# EAGLE design BCP_Experimental_1 (EAGLE 9.6.1)
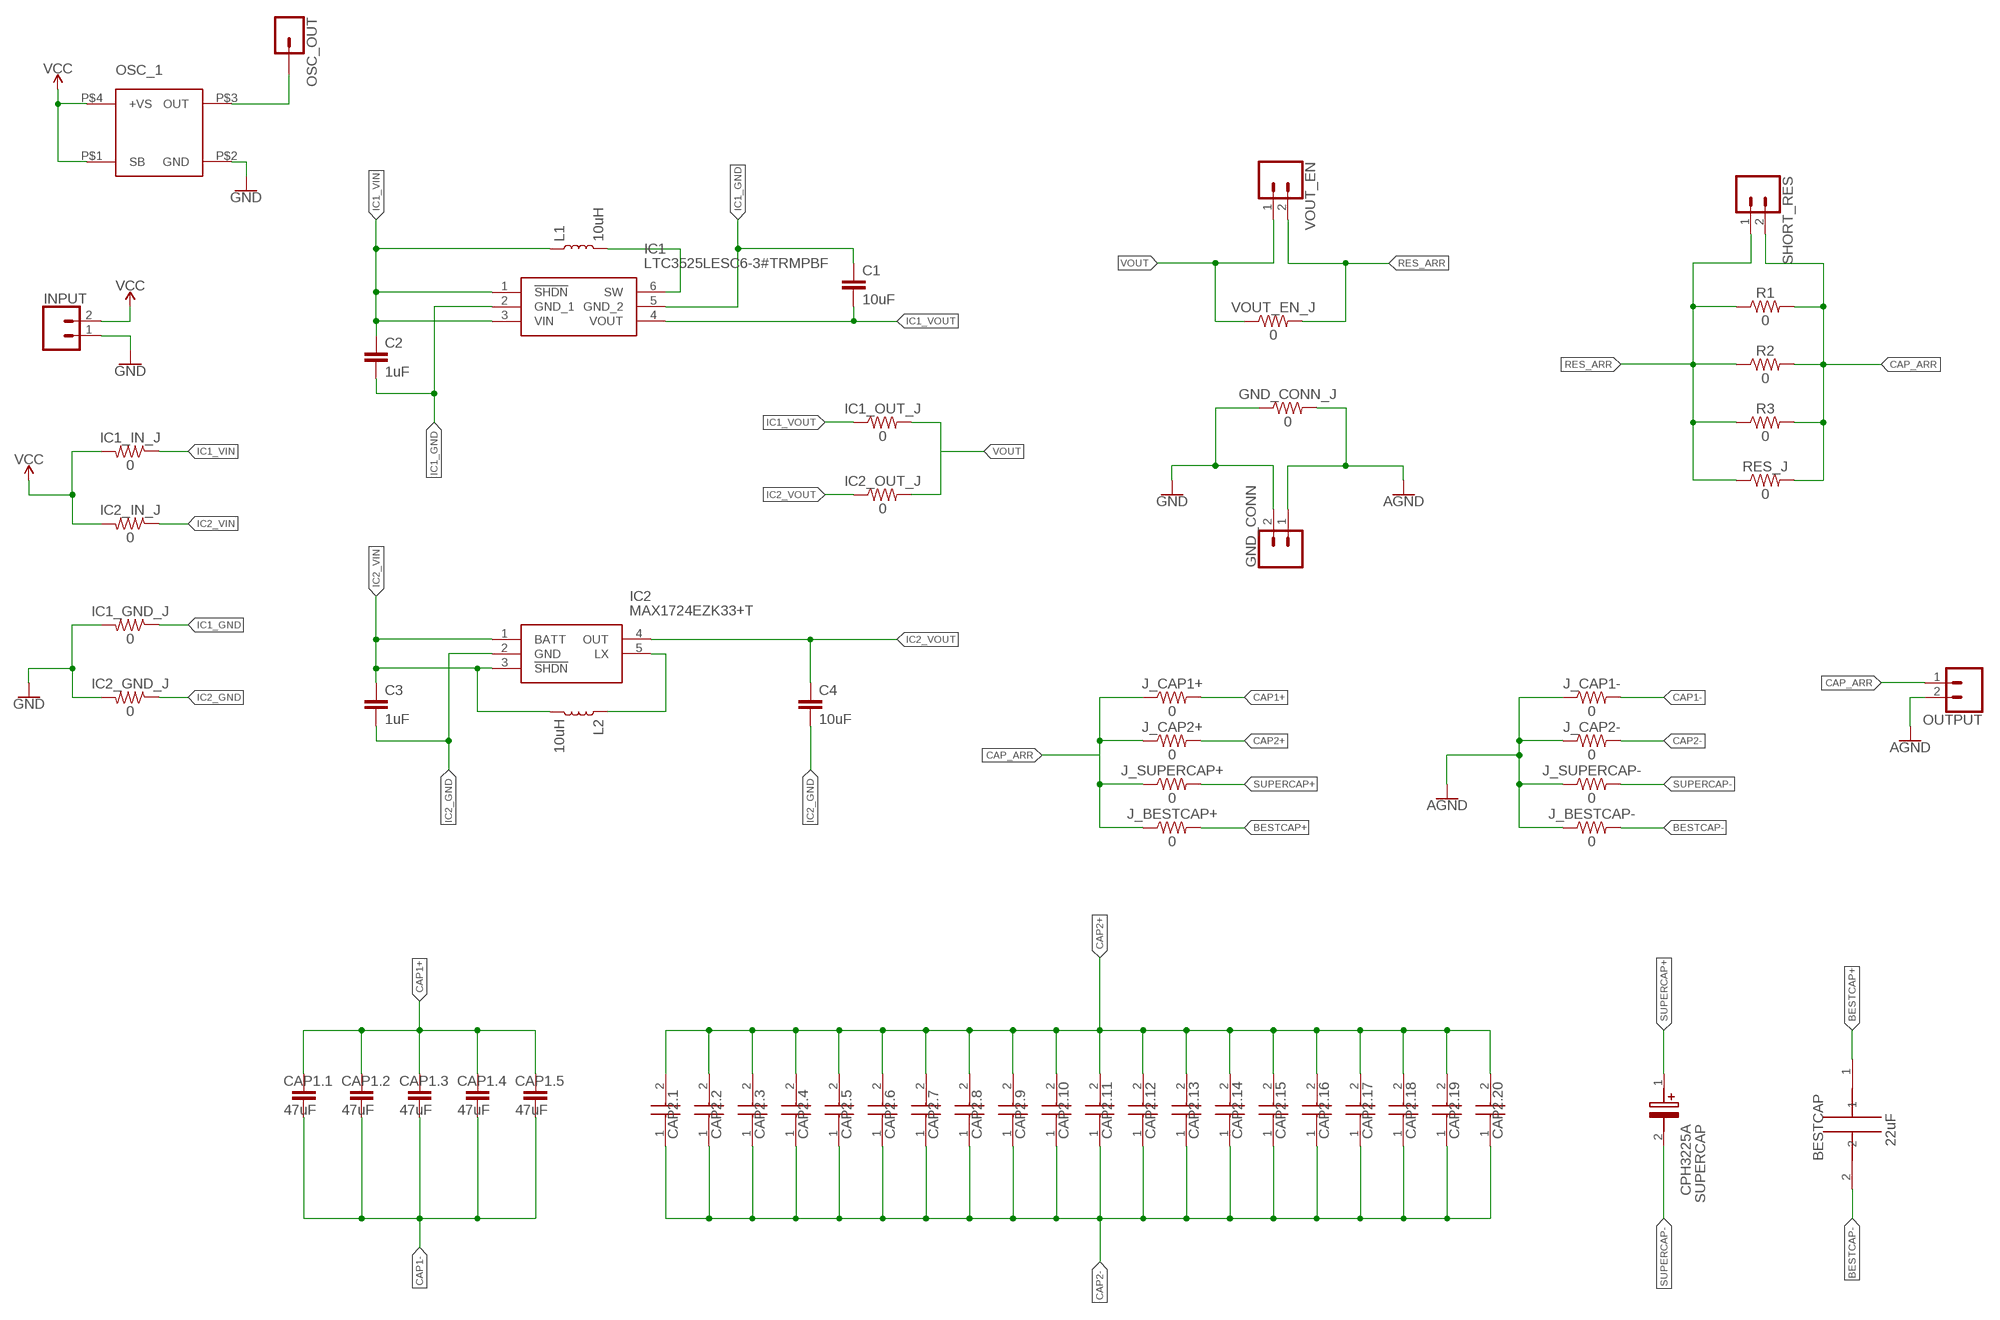
[diagram p0: schematic, sheet 1]

## Parts
BESTCAP  BZ054B223ZNB  [BZ054B223ZNB]
C1  10uF  CAP-0603  [0603]
C2  1uF  CAP-0603  [0603]
C3  1uF  CAP-0603  [0603]
C4  10uF  CAP-0603  [0603]
CAP1.1  47uF  CAP-1206  [1206]
CAP1.2  47uF  CAP-1206  [1206]
CAP1.3  47uF  CAP-1206  [1206]
CAP1.4  47uF  CAP-1206  [1206]
CAP1.5  47uF  CAP-1206  [1206]
CAP2.1  AMK432BJ477MM-T  [CAPC4532X270N]
CAP2.2  AMK432BJ477MM-T  [CAPC4532X270N]
CAP2.3  AMK432BJ477MM-T  [CAPC4532X270N]
CAP2.4  AMK432BJ477MM-T  [CAPC4532X270N]
CAP2.5  AMK432BJ477MM-T  [CAPC4532X270N]
CAP2.6  AMK432BJ477MM-T  [CAPC4532X270N]
CAP2.7  AMK432BJ477MM-T  [CAPC4532X270N]
CAP2.8  AMK432BJ477MM-T  [CAPC4532X270N]
CAP2.9  AMK432BJ477MM-T  [CAPC4532X270N]
CAP2.10  AMK432BJ477MM-T  [CAPC4532X270N]
CAP2.11  AMK432BJ477MM-T  [CAPC4532X270N]
CAP2.12  AMK432BJ477MM-T  [CAPC4532X270N]
CAP2.13  AMK432BJ477MM-T  [CAPC4532X270N]
CAP2.14  AMK432BJ477MM-T  [CAPC4532X270N]
CAP2.15  AMK432BJ477MM-T  [CAPC4532X270N]
CAP2.16  AMK432BJ477MM-T  [CAPC4532X270N]
CAP2.17  AMK432BJ477MM-T  [CAPC4532X270N]
CAP2.18  AMK432BJ477MM-T  [CAPC4532X270N]
CAP2.19  AMK432BJ477MM-T  [CAPC4532X270N]
CAP2.20  AMK432BJ477MM-T  [CAPC4532X270N]
GND_CONN  CONN_02  [1X02]
GND_CONN_J  0  RESISTOR0402  [0402]
IC1  LTC3525LESC6-3#TRMPBF  [SOT65P210X100-6N]
IC1_GND_J  0  RESISTOR0402  [0402]
IC1_IN_J  0  RESISTOR0402  [0402]
IC1_OUT_J  0  RESISTOR0402  [0402]
IC2  MAX1724EZK33+T  [SOT95P275X110-5N]
IC2_GND_J  0  RESISTOR0402  [0402]
IC2_IN_J  0  RESISTOR0402  [0402]
IC2_OUT_J  0  RESISTOR0402  [0402]
INPUT  CONN_02  [1X02]
J_BESTCAP+  0  RESISTOR0402  [0402]
J_BESTCAP-  0  RESISTOR0402  [0402]
J_CAP1+  0  RESISTOR0402  [0402]
J_CAP1-  0  RESISTOR0402  [0402]
J_CAP2+  0  RESISTOR0402  [0402]
J_CAP2-  0  RESISTOR0402  [0402]
J_SUPERCAP+  0  RESISTOR0402  [0402]
J_SUPERCAP-  0  RESISTOR0402  [0402]
L1  10uH  INDUCTOR-0603-15NH  [0603]
L2  10uH  INDUCTOR-0603-15NH  [0603]
OSC_1  830202536501  [830202536501]
OSC_OUT  CONN_01  [1X01]
OUTPUT  CONN_02  [1X02]
R1  0  RESISTOR0603  [0603]
R2  0  RESISTOR0603  [0603]
R3  0  RESISTOR0603  [0603]
RES_J  0  RESISTOR0402  [0402]
SHORT_RES  CONN_02  [1X02]
SUPERCAP  CPH3225A  [CPH3225A]
VOUT_EN  CONN_02  [1X02]
VOUT_EN_J  0  RESISTOR0402  [0402]

## Nets
AGND: GND_CONN.1 GND_CONN_J.2 J_BESTCAP-.1 J_CAP1-.1 J_CAP2-.1 J_SUPERCAP-.1 OUTPUT.2
BESTCAP+: BESTCAP.1 J_BESTCAP+.2
BESTCAP-: BESTCAP.2 J_BESTCAP-.2
CAP1+: CAP1.1.1 CAP1.2.1 CAP1.3.1 CAP1.4.1 CAP1.5.1 J_CAP1+.2
CAP1-: CAP1.1.2 CAP1.2.2 CAP1.3.2 CAP1.4.2 CAP1.5.2 J_CAP1-.2
CAP2+: CAP2.1.2 CAP2.2.2 CAP2.3.2 CAP2.4.2 CAP2.5.2 CAP2.6.2 CAP2.7.2 CAP2.8.2 CAP2.9.2 CAP2.10.2 CAP2.11.2 CAP2.12.2 CAP2.13.2 CAP2.14.2 CAP2.15.2 CAP2.16.2 CAP2.17.2 CAP2.18.2 CAP2.19.2 CAP2.20.2 J_CAP2+.2
CAP2-: CAP2.1.1 CAP2.2.1 CAP2.3.1 CAP2.4.1 CAP2.5.1 CAP2.6.1 CAP2.7.1 CAP2.8.1 CAP2.9.1 CAP2.10.1 CAP2.11.1 CAP2.12.1 CAP2.13.1 CAP2.14.1 CAP2.15.1 CAP2.16.1 CAP2.17.1 CAP2.18.1 CAP2.19.1 CAP2.20.1 J_CAP2-.2
CAP_ARR: J_BESTCAP+.1 J_CAP1+.1 J_CAP2+.1 J_SUPERCAP+.1 OUTPUT.1 R1.2 R2.2 R3.2 RES_J.2 SHORT_RES.2
GND: GND_CONN.2 GND_CONN_J.1 IC1_GND_J.2 IC2_GND_J.2 INPUT.1 OSC_1.P$2(GND)
IC1_GND: C1.1 C2.2 IC1.2(GND_1) IC1.5(GND_2) IC1_GND_J.1
IC1_VIN: C2.1 IC1.1(!SHDN) IC1.3(VIN) IC1_IN_J.1 L1.1
IC1_VOUT: C1.2 IC1.4(VOUT) IC1_OUT_J.1
IC2_GND: C3.2 C4.2 IC2.2(GND) IC2_GND_J.1
IC2_VIN: C3.1 IC2.1(BATT) IC2.3(!SHDN) IC2_IN_J.1 L2.2
IC2_VOUT: C4.1 IC2.4(OUT) IC2_OUT_J.1
N$1: IC1.6(SW) L1.2
N$3: IC2.5(LX) L2.1
N$4: OSC_1.P$3(OUT) OSC_OUT.1
RES_ARR: R1.1 R2.1 R3.1 RES_J.1 SHORT_RES.1 VOUT_EN.2 VOUT_EN_J.2
SUPERCAP+: J_SUPERCAP+.2 SUPERCAP.1(+)
SUPERCAP-: J_SUPERCAP-.2 SUPERCAP.2(-)
VCC: IC1_IN_J.2 IC2_IN_J.2 INPUT.2 OSC_1.P$1(SB) OSC_1.P$4(+VS)
VOUT: IC1_OUT_J.2 IC2_OUT_J.2 VOUT_EN.1 VOUT_EN_J.1

## Library data of the parts
BESTCAP = BZ054B223ZNB:BZ054B223ZNB
C1-C4 CAP1.1-CAP1.5 = SparkFun-Capacitors:CAP
CAP2.1-CAP2.20 = AMK432BJ477MM-T:AMK432BJ477MM-T: Multilayer Ceramic Capacitors MLCC - SMD/SMT 470uF 4V X5R +/-20% 1812 HiCV Source: Datasheet <http://ds3.yuden.co.jp/TYCOMPAS/eu/detail.do?productNo=AMK432BJ477MM-T&dataUnit=M>; DESCRIPTION: Multilayer Ceramic Capacitors MLCC - SMD/SMT 470uF 4V X5R +/-20% 1812 HiCV; HEIGHT: 2.7mm; MANUFACTURER_NAME: TAIYO YUDEN; MANUFACTURER_PART_NUMBER: AMK432BJ477MM-T; MOUSER_PART_NUMBER: 963-AMK432BJ477MM-T; MOUSER_PRICE-STOCK: https://www.mouser.co.uk/ProductDetail/Taiyo-Yuden/AMK432BJ477MM-T/?qs=3jdCaFhktORSvqRP1WUzhQ%3D%3D
GND_CONN INPUT OUTPUT SHORT_RES VOUT_EN = SparkFun-Connectors:CONN_02: Multi connection point. Often used as Generic Header-pin footprint for 0.1 inch spaced/style header connections On any of the 0.1 inch spaced packages, you can populate with these: Break Away Headers - Straight <https://www.sparkfun.com/products/116> (PRT-00116) Break Away Male Headers - Right Angle <https://www.sparkfun.com/products/553> (PRT-00553) Female Headers <https://www.sparkfun.com/products/115> (PRT-00115) Break Away Headers - Machine Pin <https://www.sparkfun.com/products/117> (PRT-00117) Break Away Female Headers - Swiss Machine Pin <https://www.sparkfun.com/products/743> (PRT-00743) For SCREWTERMINALS and SPRING TERMINALS visit here: Screw Terimnals on SparkFun.com <https://www.sparkfun.com/search/results?term=Screw+Terminals> (5mm/3.5mm/2.54mm spacing) This device is also useful as a general connection point to wire up your design to another part of your project. Our various solder wires solder well into these plated through hole pads. Hook-Up Wire - Assortment (Stranded, 22 AWG) <https://www.sparkfun.com/products/11375> (PRT-11375) Hook-Up Wire - Assortment (Solid Core, 22 AWG) <https://www.sparkfun.com/products/11367> (PRT-11367) View the entire wire category on our website here <https://www.sparkfun.com/categories/141> Special notes: Molex polarized connector foot print use with: PRT-08233 with associated crimp pins and housings. 2.54_SCREWTERM for use with PRT-10571. 3.5mm Screw Terminal footprints for PRT-08084 5mm Screw Terminal footprints for use with PRT-08432
GND_CONN_J IC1_GND_J IC1_IN_J IC1_OUT_J IC2_GND_J IC2_IN_J IC2_OUT_J J_BESTCAP+ J_BESTCAP- J_CAP1+ J_CAP1- J_CAP2+ J_CAP2- J_SUPERCAP+ J_SUPERCAP- R1-R3 RES_J VOUT_EN_J = SparkFun-Resistors:RESISTOR: Generic Resistor Package
IC1 = LTC3525LESC6-3#TRMPBF:LTC3525LESC6-3#TRMPBF: Switching Voltage Regulators Low Vt Synch Boost Source: Datasheet <http://www.mouser.com/datasheet/2/609/3525laf-1267913.pdf>; ARROW_PART_NUMBER: LTC3525LESC6-3#TRMPBF; ARROW_PRICE-STOCK: https://www.arrow.com/en/products/ltc3525lesc6-3trmpbf/linear-technology; DESCRIPTION: Switching Voltage Regulators Low Vt Synch Boost; HEIGHT: 1mm; MANUFACTURER_NAME: Linear Technology; MANUFACTURER_PART_NUMBER: LTC3525LESC6-3#TRMPBF; MOUSER_PART_NUMBER: 584-C3525LESC6-3TMPF; MOUSER_PRICE-STOCK: https://www.mouser.com/Search/Refine.aspx?Keyword=584-C3525LESC6-3TMPF
IC2 = MAX1724EZK33+T:MAX1724EZK33+T: Maxim MAX1724EZK33+T, Step Up DC-DC Converter, 150mA, 5-Pin TSOT Source: Datasheet <https://datasheets.maximintegrated.com/en/ds/MAX1722-MAX1724.pdf>; DESCRIPTION: Maxim MAX1724EZK33+T, Step Up DC-DC Converter, 150mA, 5-Pin TSOT; HEIGHT: 1.1mm; MANUFACTURER_NAME: Maxim Integrated; MANUFACTURER_PART_NUMBER: MAX1724EZK33+T; MOUSER_PART_NUMBER: 700-MAX1724EZK33T; MOUSER_PRICE-STOCK: https://www.mouser.co.uk/ProductDetail/Maxim-Integrated/MAX1724EZK33%2bT/?qs=1THa7WoU59ExxSPMjwY5Kw%3D%3D
L1 L2 = SparkFun-Coils:INDUCTOR: Inductors Resist changes in electrical current. Basically a coil of wire. SparkFun Products: SparkFun Load Cell Amplifier - HX711 <https://www.sparkfun.com/products/13879> IOIO-OTG - V2.2 <https://www.sparkfun.com/products/13613>; PROD_ID: NDUC-11660; VALUE: 15nH
OSC_1 = 830202536501:830202536501
OSC_OUT = SparkFun-Connectors:CONN_01: Single connection point. Often used as Generic Header-pin footprint for 0.1 inch spaced/style header connections On any of the 0.1 inch spaced packages, you can populate with these: Break Away Headers - Straight <https://www.sparkfun.com/products/116> (PRT-00116) Break Away Male Headers - Right Angle <https://www.sparkfun.com/products/553> (PRT-00553) Female Headers <https://www.sparkfun.com/products/115> (PRT-00115) Break Away Headers - Machine Pin <https://www.sparkfun.com/products/117> (PRT-00117) Break Away Female Headers - Swiss Machine Pin <https://www.sparkfun.com/products/743> (PRT-00743) This device is also useful as a general connection point to wire up your design to another part of your project. Our various solder wires solder well into these plated through hole pads. Hook-Up Wire - Assortment (Stranded, 22 AWG) <https://www.sparkfun.com/products/11375> (PRT-11375) Hook-Up Wire - Assortment (Solid Core, 22 AWG) <https://www.sparkfun.com/products/11367> (PRT-11367) View the entire wire category on our website here <https://www.sparkfun.com/categories/141> Special notes: SMTSO-256-ET is a "flush mount" nut for a 4-40 screw. We mostly use this on specialty testbeds; it is a nice way to connect hardware to your PCB at an adjustable hieght. Also note, the SNAP packages are for using a snappable style connector. We sell a baggie of snaps and they are also used on two LilyPad designs: Snap Assortment - 30 pack (male and female) <https://www.sparkfun.com/products/11347> (DEV-11347) LilyPad Arduino SimpleSnap <https://www.sparkfun.com/products/10941> (DEV-10941) LilyPad SimpleSnap Protoboard <https://www.sparkfun.com/products/10940> (DEV-10940)
SUPERCAP = CPH3225A:CPH3225A: Supercapacitors / Ultracapacitors Reflow EDLC 3.3V, 11mF, 160 Ohm Source: Datasheet <https://www.sii.co.jp/en/me/datasheets/chip-capacitor/cph3225a/>; DESCRIPTION: Supercapacitors / Ultracapacitors Reflow EDLC 3.3V, 11mF, 160 Ohm; HEIGHT: 1mm; MANUFACTURER_NAME: Seiko Instruments Micro Energy; MANUFACTURER_PART_NUMBER: CPH3225A; MOUSER_PART_NUMBER: 628-CPH3225A; MOUSER_PRICE-STOCK: https://www.mouser.com/Search/Refine.aspx?Keyword=628-CPH3225A

## Board
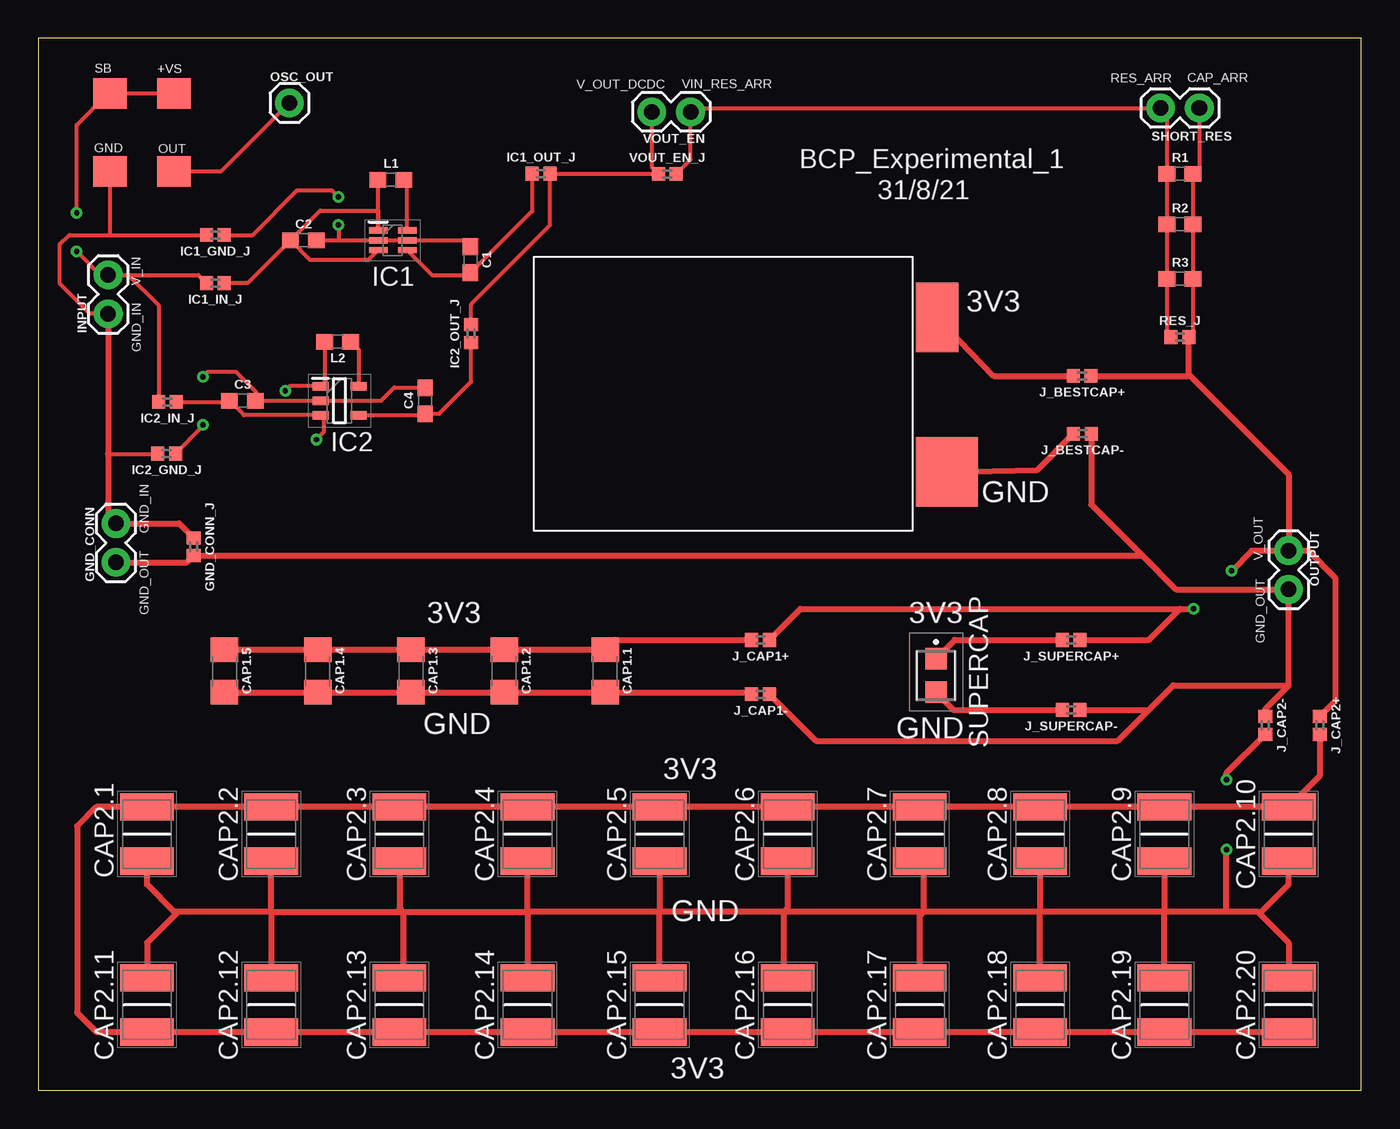
[diagram p1: board, top side]
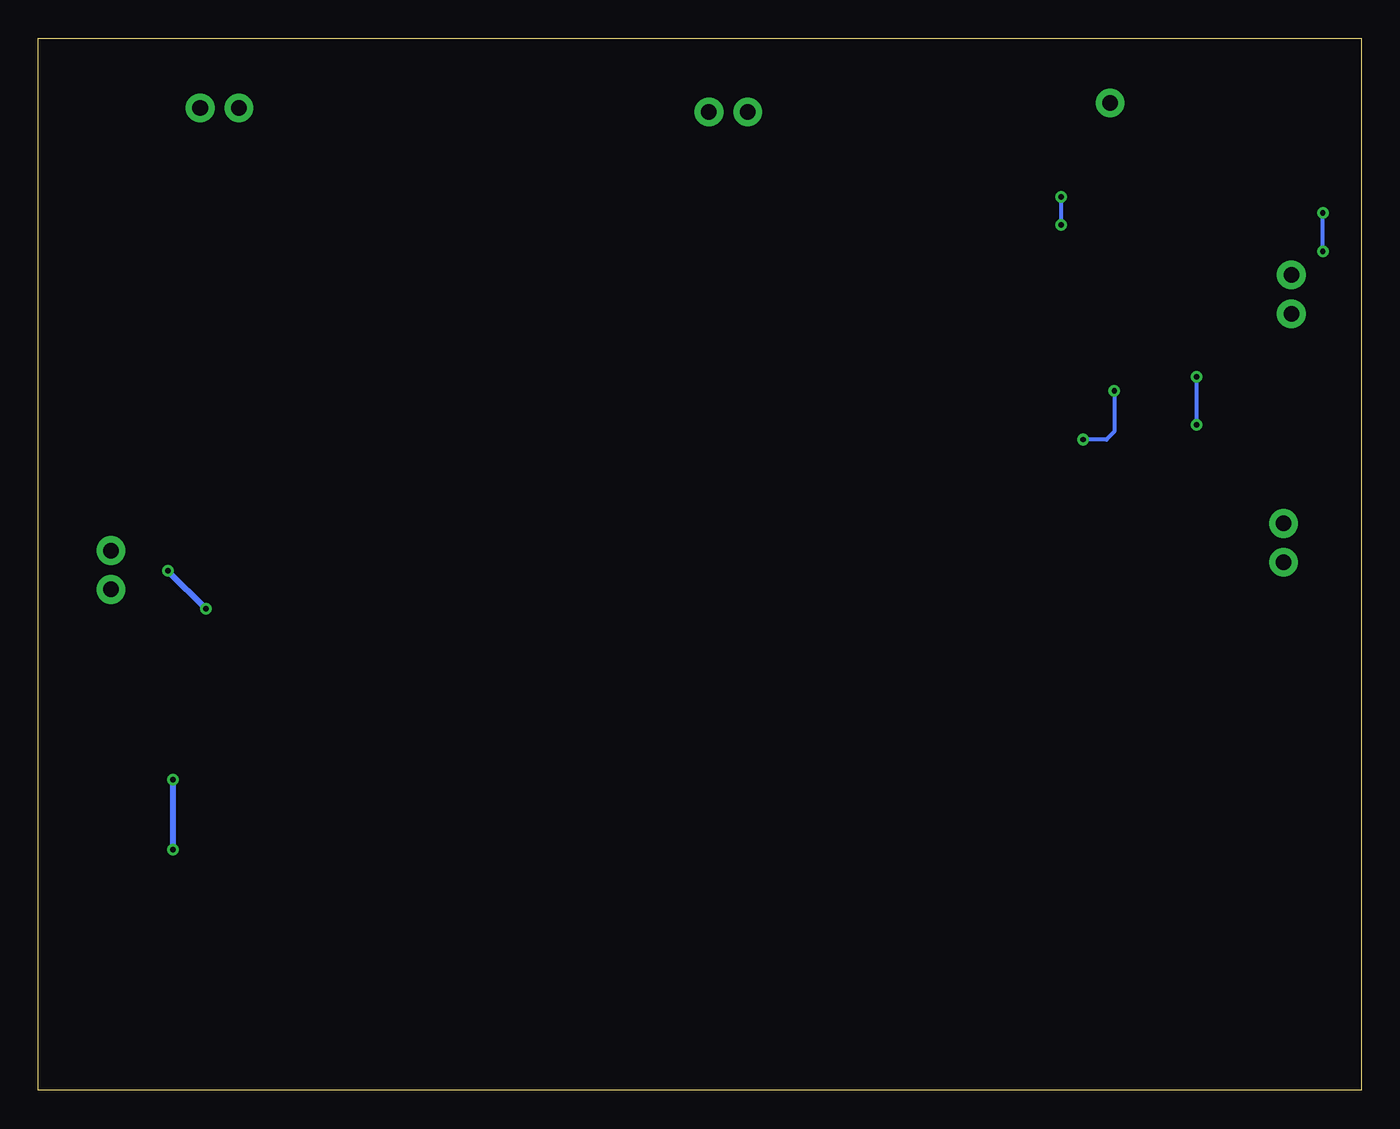
[diagram p2: board, bottom side, seen from below]

Size 86.54 x 68.82 mm. Coordinates in mm from the lower left corner, seen from the top.
Outline: 0,0 86.54,0 86.54,68.82 0,68.82 0,0
Copper layers (1*16): Top 0.035mm / dielectric 1.5mm / Bottom 0.035mm
Design rules "default": minimum track width 6mil, minimum drill 0.35mm, track to track 6mil, track to pad 6mil, pad to pad 6mil, via to via 6mil, smd to smd 6mil, copper to edge 40mil, drill to drill 6mil, minimum pad ring 10mil, minimum via ring 8mil, stop-mask expansion 4mil, vias tented up to drill 0mil, thermal gap 10mil

### Footprints (pad centres in the part's own frame; a part is rotated, then mirrored left to right if it is on the bottom)
BZ054B223ZNB = smd 2.794 x 4.572: 1 1.402,2.05 | smd 4.064 x 4.572: 2 2.037,-8.052
0603 = smd 1.1 x 1: 1 -0.85,0; 2 0.85,0
1206 = smd 1.6 x 1.8: 1 -1.4,0; 2 1.4,0
CAPC4532X270N = smd 1.78 x 3.52: 1 -1.77,0; 2 1.77,0
1X02 = drill 1.016 pad 1.88: 1 0,0; 2 2.54,0
0402 = smd 0.85 x 0.9: 1 -0.58,0; 2 0.58,0
SOT65P210X100-6N = smd 1.2 x 0.4: 1 -0.95,0.65; 2 -0.95,0; 3 -0.95,-0.65; 4 0.95,-0.65; 5 0.95,0; 6 0.95,0.65
SOT95P275X110-5N = smd 1.05 x 0.55: 1 -1.25,0.95; 2 -1.25,0; 3 -1.25,-0.95; 4 1.25,-0.95; 5 1.25,0.95
830202536501 = smd 2 x 2.2: P$1 0.9,1; P$2 6,1; P$3 6,5.2; P$4 0.9,5.2
1X01 = drill 1.016 pad 1.88: 1 0,0
CPH3225A = smd 1.4 x 1.4: 1 -0.8,0.3; 2 1.4,0.3

### Placement (x,y rotation side)
BESTCAP  57.4,48.51 0 top
C1  28.27,54.33 270 top
C2  17.35,55.6 0 top
C3  13.36,45.11 0 top
C4  25.3,45.11 90 top
CAP1.1  37.08,27.43 270 top
CAP1.2  30.48,27.43 270 top
CAP1.3  24.38,27.43 270 top
CAP1.4  18.29,27.43 270 top
CAP1.5  12.19,27.43 270 top
CAP2.1  7.11,16.76 90 top
CAP2.2  15.24,16.76 90 top
CAP2.3  23.62,16.76 90 top
CAP2.4  32,16.76 90 top
CAP2.5  40.64,16.76 90 top
CAP2.6  49.02,16.76 90 top
CAP2.7  57.66,16.76 90 top
CAP2.8  65.53,16.76 90 top
CAP2.9  73.66,16.76 90 top
CAP2.10  81.79,16.76 90 top
CAP2.11  7.11,5.59 270 top
CAP2.12  15.24,5.59 270 top
CAP2.13  23.62,5.59 270 top
CAP2.14  32,5.59 270 top
CAP2.15  40.64,5.59 270 top
CAP2.16  49.02,5.59 270 top
CAP2.17  57.66,5.59 270 top
CAP2.18  65.53,5.59 270 top
CAP2.19  73.66,5.59 270 top
CAP2.20  81.79,5.59 270 top
GND_CONN  5.08,34.54 90 top
GND_CONN_J  10.16,35.56 270 top
IC1  23.19,55.6 0 top
IC1_GND_J  11.58,55.96 180 top
IC1_IN_J  11.58,52.81 180 top
IC1_OUT_J  32.89,59.97 0 top
IC2  19.71,45.11 0 top
IC2_GND_J  8.41,41.66 180 top
IC2_IN_J  8.46,45.03 180 top
IC2_OUT_J  28.32,49.5 90 top
INPUT  4.57,50.8 90 top
J_BESTCAP+  68.28,46.74 180 top
J_BESTCAP-  68.3,42.95 180 top
J_CAP1+  47.24,29.46 180 top
J_CAP1-  47.24,25.91 180 top
J_CAP2+  83.82,23.88 270 top
J_CAP2-  80.26,23.88 270 top
J_SUPERCAP+  67.56,29.46 180 top
J_SUPERCAP-  67.56,24.89 180 top
L1  23.06,59.56 0 top
L2  19.58,48.97 180 top
OSC_1  3.68,66.12 270 top
OSC_OUT  16.43,64.59 0 top
OUTPUT  81.79,35.31 270 top
R1  74.68,59.94 0 top
R2  74.68,56.64 0 top
R3  74.68,53.09 0 top
RES_J  74.68,49.28 0 top
SHORT_RES  73.41,64.26 0 top
SUPERCAP  58.42,27.43 270 top
VOUT_EN  40.13,64.01 0 top
VOUT_EN_J  41.15,59.94 0 top

### Tracks (layer width: path | path; a pad name or v marks a point on that pad's centre or on a via)
AGND
  Top 0.406: J_BESTCAP-.1 68.88,38.31 72.21,34.98 | GND_CONN.1 9.72,34.54 GND_CONN_J.2 72.21,34.98 | 81.79,26.49 OUTPUT.2 74.42,32.77 72.21,34.98 | J_SUPERCAP-.1 72.64,24.89 | 81.79,26.49 74.24,26.49 72.64,24.89 | J_CAP1-.1 50.87,22.86 70.61,22.86 72.64,24.89 | J_CAP2-.1 80.26,24.96 81.79,26.49
BESTCAP+
  Top 0.406: BESTCAP.1 62.48,46.74 J_BESTCAP+.2
BESTCAP-
  Top 0.406: BESTCAP.2 65.36,40.59 J_BESTCAP-.2
CAP1+
  Top 0.406: CAP1.5.1 CAP1.4.1 CAP1.3.1 CAP1.2.1 CAP1.1.1 37.72,29.46 J_CAP1+.2
CAP1-
  Top 0.406: CAP1.5.2 CAP1.4.2 CAP1.3.2 CAP1.2.2 CAP1.1.2 46.54,26.03 J_CAP1-.2
CAP2+
  Top 0.406: CAP2.20.2 CAP2.19.2 CAP2.18.2 CAP2.17.2 CAP2.16.2 CAP2.15.2 CAP2.14.2 CAP2.13.2 CAP2.12.2 CAP2.11.2 3.8,3.82 2.54,5.08 2.54,17.27 3.8,18.53 CAP2.1.2 CAP2.2.2 CAP2.3.2 CAP2.4.2 CAP2.5.2 CAP2.6.2 CAP2.7.2 CAP2.8.2 CAP2.9.2 CAP2.10.2 83.82,20.57 J_CAP2+.2
CAP2-  (via drill 0.35)
  Top 0.406: 79.76,11.68 80,11.68 81.79,13.47 CAP2.10.1 | 79.76,11.68 81.79,9.65 CAP2.20.1 | 79.76,11.68 77.72,11.68 | 77.72,11.68 73.66,11.68 | 73.66,11.68 65.53,11.68 | 65.53,11.68 57.91,11.68 | 57.91,11.68 48.77,11.68 | 48.77,11.68 40.64,11.68 | 40.64,11.68 32,11.68 | 23.88,11.68 32,11.68 | 15.24,11.68 23.88,11.68 | 15.24,11.68 9.14,11.68 | 9.14,11.68 8.9,11.68 7.11,13.47 CAP2.1.1 | 9.14,11.68 7.11,9.65 CAP2.11.1 | 15.24,11.68 CAP2.12.1 | 15.24,11.68 CAP2.2.1 | CAP2.3.1 23.62,11.94 23.88,11.68 | 23.88,11.68 23.88,7.61 CAP2.13.1 | 32,11.68 CAP2.4.1 | 32,11.68 CAP2.14.1 | CAP2.5.1 40.64,11.68 | CAP2.15.1 40.64,11.68 | CAP2.6.1 49.02,11.94 48.77,11.68 | CAP2.16.1 48.77,7.61 48.77,11.68 | CAP2.7.1 57.91,14.74 57.91,11.68 | CAP2.17.1 57.66,11.43 57.91,11.68 | CAP2.8.1 65.53,11.68 | CAP2.18.1 65.53,11.68 | CAP2.9.1 73.66,11.68 | CAP2.19.1 73.66,11.68 | 77.72,11.68 v77.72,15.75 | v77.72,20.32 77.72,20.76 J_CAP2-.2
  Bottom 0.406: v77.72,15.75 v77.72,20.32
CAP_ARR  (via drill 0.35)
  Top 0.254: SHORT_RES.2 75.95,60.36 R1.2 R2.2 R3.2 75.53,49.55 RES_J.2
  Top 0.406: J_BESTCAP+.1 75.18,46.74 75.26,46.81 | 75.26,46.81 RES_J.2 | 75.26,46.81 81.79,40.28 OUTPUT.1 | OUTPUT.1 83.06,35.31 84.84,33.53 84.84,25.47 J_CAP2+.1 | J_SUPERCAP+.1 72.64,29.46 74.68,31.5 | J_CAP1+.1 49.86,31.5 74.68,31.5 | 74.68,31.5 v75.56,31.5 | v78.05,33.98 79.38,35.31 OUTPUT.1
  Bottom 0.406: v75.56,31.5 v78.05,33.98
GND
  Top 0.254: 4.57,41.63 7.8,41.63 IC2_GND_J.2 | INPUT.1 3.38,50.8 1.42,52.76 1.42,55.35 2.03,55.96 4.62,55.96 | 4.62,55.96 IC1_GND_J.2 | OSC_1.P$2 4.68,56.02 4.62,55.96
  Top 0.406: INPUT.1 4.57,41.63 4.57,37.59 GND_CONN.2 9.22,37.08 GND_CONN_J.1
IC1_GND  (via drill 0.35)
  Top 0.254: C2.2 19.63,55.6 | 19.63,55.6 IC1.2 IC1.5 27.85,55.6 C1.1 | v19.63,58.45 19.2,58.88 16.94,58.88 14.02,55.96 IC1_GND_J.1 | v19.63,56.62 19.63,55.6
  Bottom 0.254: v19.63,58.45 v19.63,56.62
IC1_VIN
  Top 0.254: C2.1 18.45,57.56 22.24,57.56 IC1.1 22.24,59.54 L1.1 | C2.1 17.77,54.33 21.62,54.33 IC1.3 | IC1_IN_J.1 13.7,52.81 C2.1
IC1_VOUT
  Top 0.254: IC1.4 25.78,53.31 28.1,53.31 C1.2 29.03,54.24 29.05,54.24 32.31,57.51 IC1_OUT_J.1
IC2_GND  (via drill 0.35)
  Top 0.254: C3.2 14.25,45.11 | 14.25,45.11 IC2.2 22.43,45.11 23.29,45.97 25.29,45.97 C4.2 | IC2_GND_J.1 10.77,43.44 v10.77,43.54 | v10.77,46.69 11.1,47.02 12.9,47.02 14.25,45.67 14.25,45.11
  Bottom 0.254: v10.77,43.54 v10.77,46.69
IC2_VIN  (via drill 0.35)
  Top 0.254: L2.2 18.73,46.33 IC2.1 16.45,46.06 v16.15,45.77 | v18.19,42.57 18.69,43.08 18.69,43.93 IC2.3 13.46,44.16 C3.1 12.43,45.03 IC2_IN_J.1
  Bottom 0.254: v16.15,45.77 16.15,43.08 16.66,42.57 v18.19,42.57
IC2_VOUT
  Top 0.254: IC2.4 25.2,44.16 C4.1 26.23,44.26 28.32,46.35 IC2_OUT_J.1
N$1
  Top 0.254: IC1.6 24.14,59.34 L1.2
N$3
  Top 0.254: L2.1 20.96,48.44 IC2.5
N$4
  Top 0.254: OSC_OUT.1 11.96,60.12 OSC_1.P$3
RES_ARR
  Top 0.254: RES_J.1 73.83,49.55 R3.1 R2.1 R1.1 73.83,63.84 SHORT_RES.1 42.93,64.26 VOUT_EN.2 42.67,60.89 VOUT_EN_J.2
SUPERCAP+
  Top 0.406: SUPERCAP.1 59.95,29.46 J_SUPERCAP+.2
SUPERCAP-
  Top 0.406: SUPERCAP.2 59.86,24.89 J_SUPERCAP-.2
VCC  (via drill 0.35)
  Top 0.254: 5.89,53.34 INPUT.2 4.06,53.34 v2.52,54.89 | IC2_IN_J.2 7.88,51.35 5.89,53.34 | 5.89,53.34 10.47,53.34 IC1_IN_J.2 | v2.52,57.4 2.52,63.15 4.58,65.22 OSC_1.P$1 OSC_1.P$4
  Bottom 0.254: v2.52,54.89 v2.52,57.4
VOUT
  Top 0.254: VOUT_EN.1 40.13,60.38 VOUT_EN_J.1 40.54,59.97 IC1_OUT_J.2 33.47,56.58 28.32,51.43 IC2_OUT_J.2

### Text on the board
tPlace: SB | +VS | V_OUT_DCDC | VIN_RES_ARR | RES_ARR | CAP_ARR | GND | OUT | BCP_Experimental_1 | 31/8/21 | V_IN | 3V3 | GND_IN | GND | GND_IN | V_OUT | GND_OUT | 3V3 | 3V3 | GND_OUT | GND | GND | 3V3 | GND | 3V3